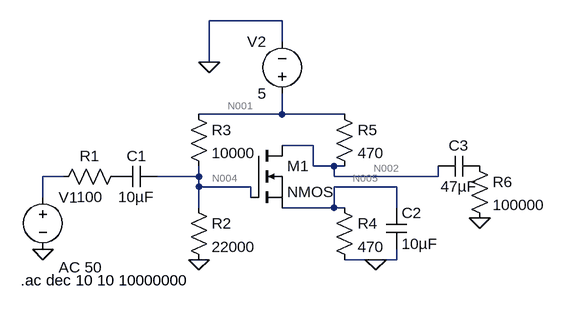
[diagram p0: schematic Draft3.asc]
Draft3.asc, the LTspice schematic file:
Version 4
SHEET 1 880 680
WIRE 368 -112 256 -112
WIRE 368 -80 368 -112
WIRE 256 -48 256 -112
WIRE 368 32 368 0
WIRE 368 32 240 32
WIRE 464 32 368 32
WIRE 416 80 368 80
WIRE 416 112 416 80
WIRE 448 112 416 112
WIRE 464 112 448 112
WIRE 32 128 0 128
WIRE 240 128 240 112
WIRE 240 128 176 128
WIRE 448 128 448 112
WIRE 608 128 608 112
WIRE 608 128 448 128
WIRE 240 144 240 128
WIRE 320 144 240 144
WIRE 544 144 448 144
WIRE 0 160 0 128
WIRE 320 160 320 144
WIRE 240 176 240 144
WIRE 448 176 448 144
WIRE 448 176 368 176
WIRE 464 176 448 176
WIRE 544 176 544 144
WIRE 512 256 464 256
WIRE 544 256 544 240
WIRE 544 256 512 256
FLAG 0 240 0
FLAG 672 192 0
FLAG 512 256 0
FLAG 240 256 0
FLAG 256 -48 0
SYMBOL voltage 0 144 R0
WINDOW 123 24 124 Left 2
WINDOW 39 0 0 Left 0
SYMATTR InstName V1
SYMATTR Value ""
SYMATTR Value2 AC 50
SYMBOL res 128 112 R90
WINDOW 0 0 56 VBottom 2
WINDOW 3 32 56 VTop 2
SYMATTR InstName R1
SYMATTR Value 100
SYMBOL cap 176 112 R90
WINDOW 0 0 32 VBottom 2
WINDOW 3 32 32 VTop 2
SYMATTR InstName C1
SYMATTR Value 10µF
SYMBOL res 224 160 R0
SYMATTR InstName R2
SYMATTR Value 22000
SYMBOL res 224 16 R0
SYMATTR InstName R3
SYMATTR Value 10000
SYMBOL res 448 160 R0
SYMATTR InstName R4
SYMATTR Value 470
SYMBOL cap 528 176 R0
SYMATTR InstName C2
SYMATTR Value 10µF
SYMBOL res 448 16 R0
SYMATTR InstName R5
SYMATTR Value 470
SYMBOL cap 608 96 M90
WINDOW 0 0 32 VBottom 2
WINDOW 3 32 32 VTop 2
SYMATTR InstName C3
SYMATTR Value 47µF
SYMBOL res 656 96 R0
SYMATTR InstName R6
SYMATTR Value 100000
SYMBOL voltage 368 16 R180
WINDOW 0 24 96 Left 2
WINDOW 3 24 16 Left 2
WINDOW 123 0 0 Left 0
WINDOW 39 0 0 Left 0
SYMATTR InstName V2
SYMATTR Value 5
SYMBOL nmos 320 80 R0
SYMATTR InstName M1
TEXT -34 288 Left 2 !.ac dec 10 10 10000000

The netlist it stands for:
* Draft3.asc
V1 N003 0 AC 50
R1 P001 N003 100
C1 N004 P001 10µF
R2 N004 0 22000
R3 N001 N004 10000
R4 N005 0 470
C2 N005 0 10µF
R5 N001 N002 470
C3 N002 P002 47µF
R6 P002 0 100000
V2 N001 0 5
M1 N002 N004 N005 N005 NMOS
.model NMOS NMOS
.model PMOS PMOS
.lib standard.mos
.ac dec 10 10 10000000
.backanno
.end

* Results of the author's LTspice run, read from the files saved beside the schematic
* Operating Point, zero values left out:
*   V(n004) = 3.438 V
*   V(n001) = 5 V
*   V(n005) = 53.81 mV
*   V(n002) = 4.946 V
*   Id(M1) = 114.5 µA
*   Ib(M1) = -4.902 pA
*   Is(M1) = -114.5 µA
*   I(R5) = 114.5 µA
*   I(R4) = 114.5 µA
*   I(R3) = 156.2 µA
*   I(R2) = 156.2 µA
*   I(V2) = -270.7 µA
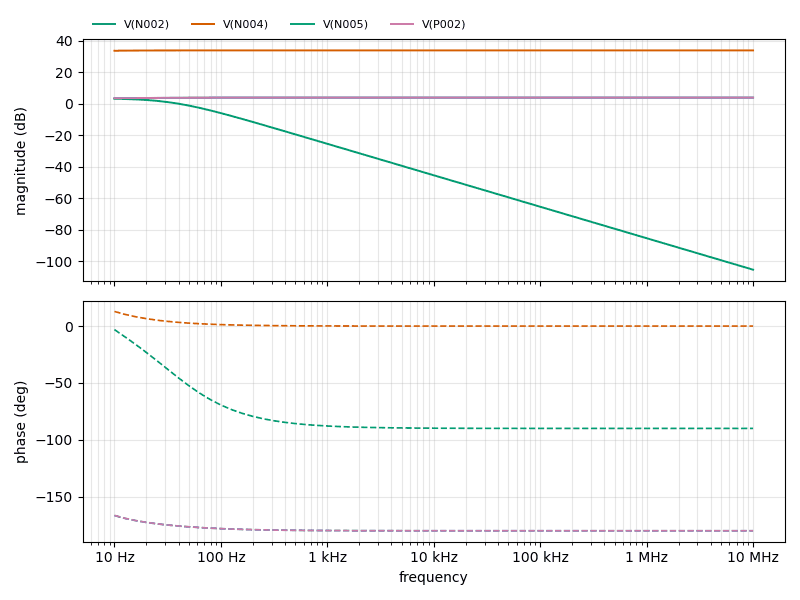
[diagram p1: AC Analysis of Draft3.asc, plotted from the saved traces]
* AC Analysis, 1 run:
*   V(N002): 3.39 dB at 10 Hz, 3.86 dB at 10 MHz, peak 3.86 dB at 10 MHz
*   V(N004): 33.63 dB at 10 Hz, 33.85 dB at 10 MHz, peak 33.85 dB at 10 MHz
*   V(N005): 3.07 dB at 10 Hz, -105.50 dB at 10 MHz, peak 3.07 dB at 10 Hz, 3 dB below the peak at 39.31 Hz
*   V(P002): 3.39 dB at 10 Hz, 3.86 dB at 10 MHz, peak 3.86 dB at 10 MHz